# EAGLE design CO2_Sensor_SCD40 (EAGLE 9.6.2)
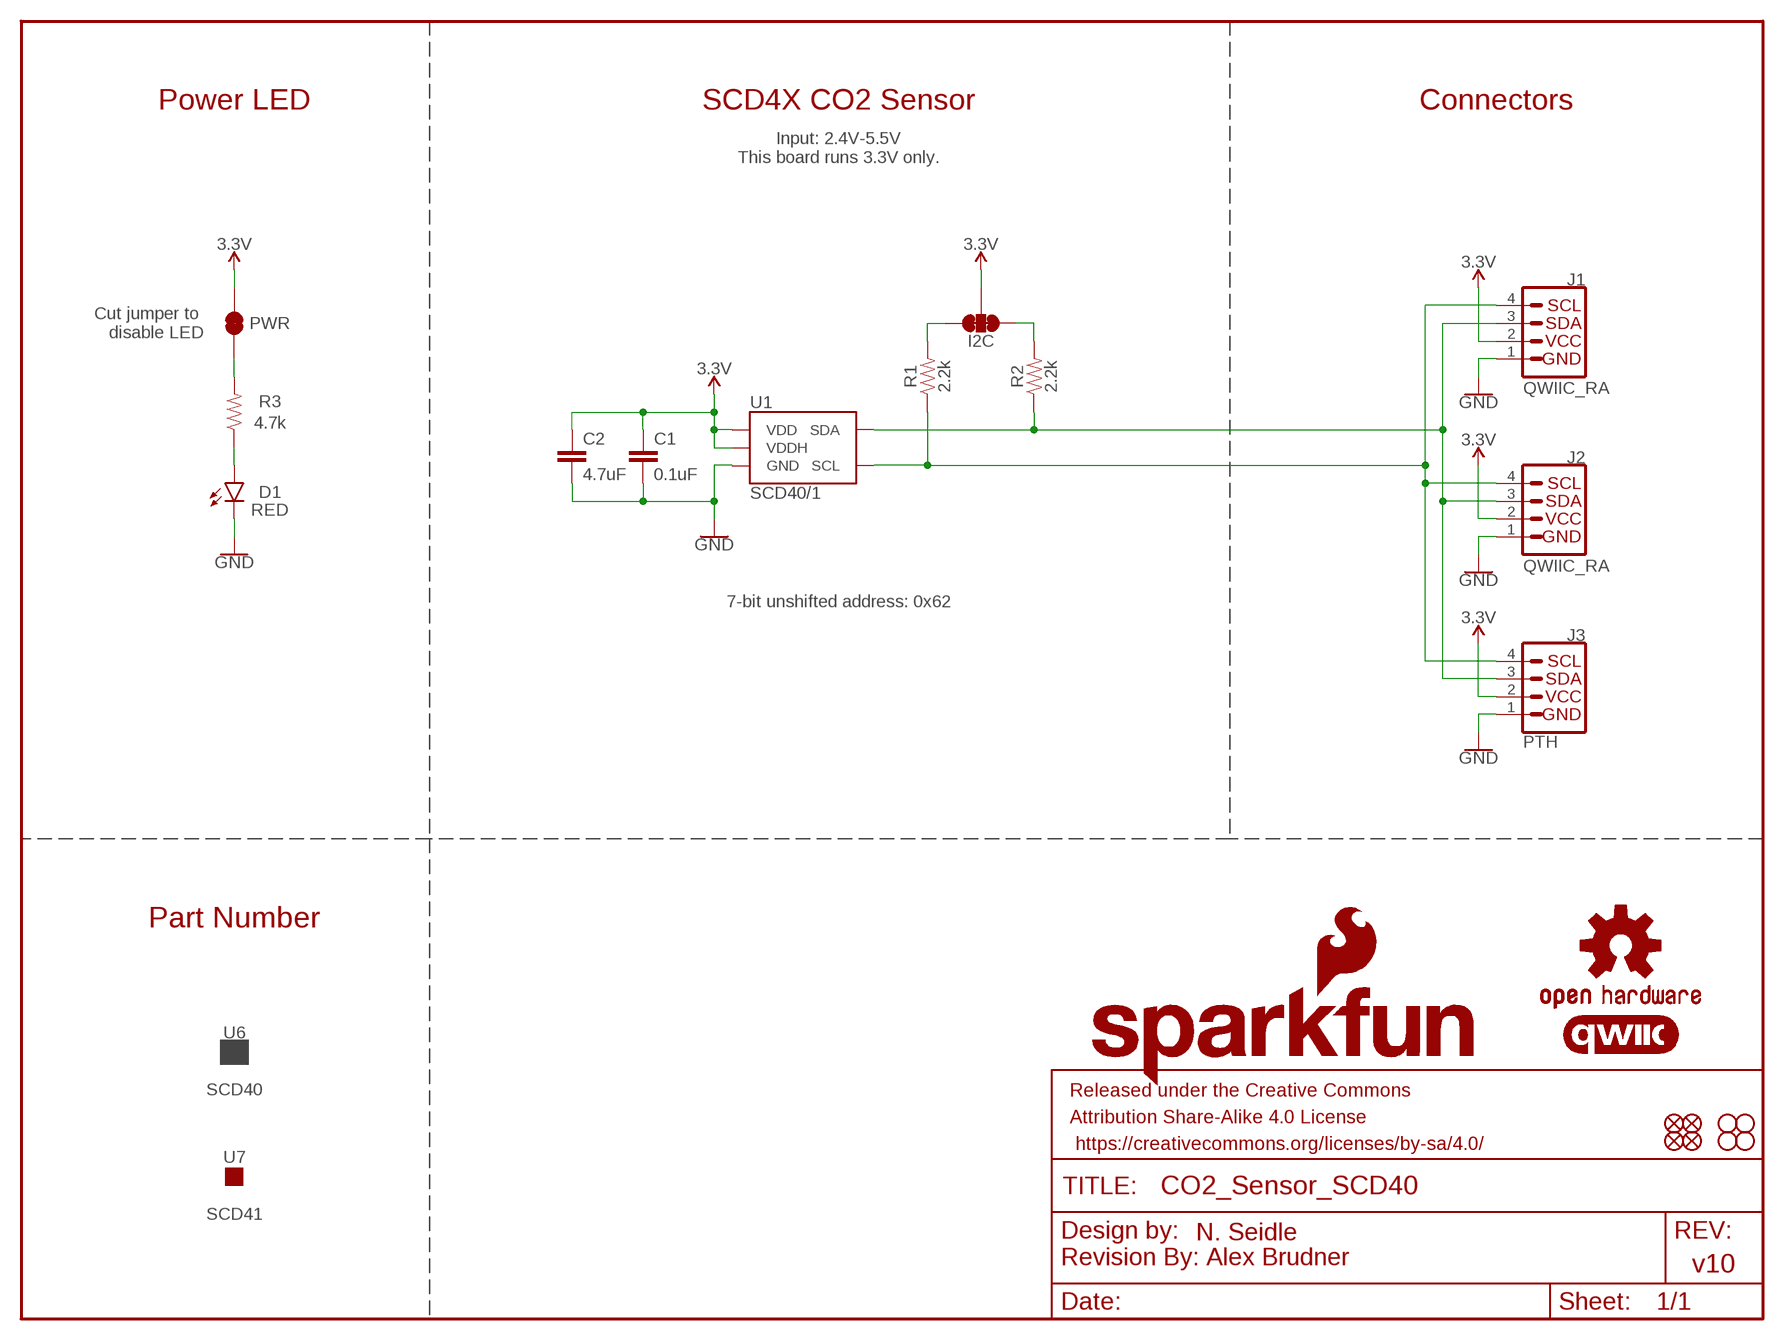
[diagram p0: schematic, sheet 1]

## Parts
C1  0.1uF  0.1UF-0603-25V-10%-X7R-WE  [0603]
C2  4.7uF  4.7UF-0603-6.3V-(10%)  [0603]
D1  RED  LED-RED_0603-KB  [LED-0603]
FD1  FIDUCIALUFIDUCIAL  [FIDUCIAL-MICRO]
FD2  FIDUCIALUFIDUCIAL  [FIDUCIAL-MICRO]
FD3  FIDUCIALUFIDUCIAL  [FIDUCIAL-MICRO]
FD4  FIDUCIALUFIDUCIAL  [FIDUCIAL-MICRO]
FRAME1  FRAME-LETTER  [CREATIVE_COMMONS]
H1  STAND-OFF  [STAND-OFF]
H2  STAND-OFF  [STAND-OFF]
H3  STAND-OFF  [STAND-OFF]
H4  STAND-OFF  [STAND-OFF]
I2C  I2C  JUMPER-SMT_3_2-NC_TRACE_SILK  [SMT-JUMPER_3_2-NC_TRACE_SILK]
J1  QWIIC_RA  QWIIC_CONNECTORJS-1MM  [JST04_1MM_RA]
J2  QWIIC_RA  QWIIC_CONNECTORJS-1MM  [JST04_1MM_RA]
J3  PTH  I2C_STANDARD_NO_SILK  [1X04_NO_SILK]
LOGO1  QWIIC_LOGO_CONNECTOR  [QWIIC_5.5MM]
LOGO2  OSHW-LOGOS  [OSHW-LOGO-S]
LOGO3  SFE_LOGO_NAME_FLAMEBLANK  [BLANK]
PWR  PWR  JUMPER-SMT_2_NC_TRACE_SILK  [SMT-JUMPER_2_NC_TRACE_SILK]
R1  2.2k  2.2KOHM-0603-1/10W-1%  [0603]
R2  2.2k  2.2KOHM-0603-1/10W-1%  [0603]
R3  4.7k  4.7KOHM-0603-1/10W-1%  [0603]
U1  SCD40/1  SCD4X  [SCD4X]
U6  SCD40  PROD_ID_PASTE_NO-SILK  [PRODUCT_IDENT_PASTE_NO-SILK]
U7  SCD41  PROD_ID_NO-PASTE_NO_SILK  [PRODUCT_IDENT_NO_NO-SILK]

## Nets
3.3V: C1.1 C2.1 I2C.2 J1.2 J2.2 J3.2 PWR.2 U1.7(VDD) U1.19(VDDH)
GND: C1.2 C2.2 D1.C J1.1 J2.1 J3.1 U1.6(GND) U1.20(GND) U1.CP(GND)
N$3: I2C.1 R2.2
N$4: I2C.3 R1.2
N$5: PWR.1 R3.2
N$6: D1.A R3.1
SCL: J1.4 J2.4 J3.4 R1.1 U1.9(SCL)
SDA: J1.3 J2.3 J3.3 R2.1 U1.10(SDA)

## Notes on the sheet
- Power LED | SCD4X CO2 Sensor | Connectors
- Input: 2.4V-5.5V
  This board runs 3.3V only.
- Cut jumper to 
  disable LED
- 7-bit unshifted address: 0x62
- Part Number

## Library data of the parts
C1 = SparkFun-Capacitors:0.1UF: 0.1µF ceramic capacitors A capacitor is a passive two-terminal electrical component used to store electrical energy temporarily in an electric field.; PROD_ID: CAP-16503
C2 = SparkFun-Capacitors:4.7UF: 4.7µF ceramic capacitors A capacitor is a passive two-terminal electrical component used to store electrical energy temporarily in an electric field.; PROD_ID: CAP-08280
D1 = SparkFun-LED:LED-RED: Red SMD LED Used in manufacturing of most products at SparkFun Packages: 0603 - KB - KingBright (DIO-17976) SMD 0603 package [Datasheet] <https://www.kingbrightusa.com/images/catalog/SPEC/APT1608SURCK.pdf> 0603 - (DIO-00819, has gone EOL) SMD 0603 package 0603 SMART - SMD 0603 SMART package ( more efficient and expensive)[Product Link] <http://www.osram-os.com/Graphics/XPic2/00077099_0.pdf> 1206 - SMD1206 package [Product Link] <https://www.sparkfun.com/datasheets/DevTools/LilyPad/Q150OVS4.pdff> SparkFun Products: Pro Mini 328 -5V <https://www.sparkfun.com/products/821> RedBoard <https://www.sparkfun.com/products/12757> IOIO-OTG <https://www.sparkfun.com/products/13613>; PROD_ID: DIO-17976
FD1-FD4 = SparkFun-Aesthetics:FIDUCIAL: Fiducial Alignment Points Point-of-reference for pick-and-place machines and other optical instruments.
FRAME1 = SparkFun-Aesthetics:FRAME-LETTER: Schematic Frame - Letter Standard 8.5x11 US Letter frame; BASEDON: Revision By: Alex Brudner; DESIGNER: N. Seidle; REV: v10
H1-H4 = SparkFun-Hardware:STAND-OFF: Stand Off Drill holes for mechanically mounting via screws, standoffs, etc. Note: Use the keepout ring to avoid running the screw head into surrounding components. Variant Overviews STAND-OFF - Mechanical footprint for a #4 phillips button head screw. STAND-OFF-TIGHT - Mechanical footprint for a #4 phillips button head screw, Example SparkFun Products Screw - Phillips Head (1/4", 4-40, 10 pack) <https://www.sparkfun.com/products/10453> (PRT-10453) Screw - Phillips Head (1/2", 4-40, 10 pack) <https://www.sparkfun.com/products/10452> (PRT-10452) Screw - Phillips Head (3/4", 4-40, 10 pack) <https://www.sparkfun.com/products/10451> (PRT-10451) Screw - Phillips Head (1", 4-40, 10 pack) <https://www.sparkfun.com/products/10450> (PRT-10450)
I2C = SparkFun-Jumpers:JUMPER-SMT_3_2-NC_TRACE: Normally closed trace jumper (2 of 2 connections) This jumper has a trace between all three pads so they are normally closed (NC). Use a razor knife to open the connection(s). For best results follow the IPC guidelines for cutting traces: Cutout at least 0.063 mm (0.005 in). Remove all loose material to clean up the cut area. Seal the cut with an approved epoxy. Reapply solder to reclose the connection(s).
J1 J2 = SparkFun-Connectors:QWIIC_CONNECTOR: SparkFun I2C Standard Qwiic Connector An SMD 1mm pitch JST connector makes it easy and quick (get it? Qwiic?) to connect I2C devices to each other. The Qwiic system <http://www.sparkfun.com/qwiic> enables fast and solderless connection between popular platforms and various sensors and actuators. We carry 200mm <https://www.sparkfun.com/products/14204>, 100mm <https://www.sparkfun.com/products/14205>, 50mm <https://www.sparkfun.com/products/14206>, and breadboard friendly <https://www.sparkfun.com/products/14207> Qwiic cables. We also offer 10 pcs strips <https://www.sparkfun.com/products/14323> the SMD connectors.; PROD_ID: CONN-13694; VALUE: QWIIC_RIGHT_ANGLE
J3 = SparkFun-Connectors:I2C_STANDARD: SparkFun I2C Standard Pinout Header SparkFun has standardized on a pinout for all I2C based sensor breakouts. This pinout allows I2C boards to be plugged directly into the headers on Arduino Uno compatible boards, and to be daisy chained easily. Example SparkFun Products: SparkFun Atmospheric Sensor Breakout - BME280 <https://www.sparkfun.com/products/13676> SparkFun Altitude/Pressure Sensor Breakout - MPL3115A2 <https://www.sparkfun.com/products/11084> SparkFun TOF Range Finder Sensor - VL6180 <https://www.sparkfun.com/products/12785>
LOGO1 = SparkFun-Aesthetics:QWIIC_LOGO: Qwiic Logos for placement on schematic and PCB. The 5.5mm silk logo is best for placing next to Qwiic connector.
LOGO2 = SparkFun-Aesthetics:OSHW-LOGO: Open-Source Hardware (OSHW) Logo This logo indicates the piece of hardware it is found on incorporates a OSHW license and/or adheres to the definition of open source hardware found here: http://freedomdefined.org/OSHW
LOGO3 = SparkFun-Aesthetics:SFE_LOGO_NAME_FLAME: SparkFun Font Logo w/ Flame This is the SparkFun full logo. The logo on the schematic will always be the same size; the package variant is the height of the flame part of the logo. Default layer for the logo on the board is tSilk.
PWR = SparkFun-Jumpers:JUMPER-SMT_2_NC_TRACE: Normally closed trace jumper This jumper has a trace between two pads so it's normally closed (NC). Use a razor knife to open the connection. For best results follow the IPC guidelines for cutting traces: Cutout at least 0.063 mm (0.005 in). Remove all loose material to clean up the cut area. Seal the cut with an approved epoxy. Reapply solder to reclose the connection.
R1 R2 = SparkFun-Resistors:2.2KOHM: 2.2kΩ resistor A resistor is a passive two-terminal electrical component that implements electrical resistance as a circuit element. Resistors act to reduce current flow, and, at the same time, act to lower voltage levels within circuits. - Wikipedia; PROD_ID: RES-08272
R3 = SparkFun-Resistors:4.7KOHM: 4.7kΩ resistor A resistor is a passive two-terminal electrical component that implements electrical resistance as a circuit element. Resistors act to reduce current flow, and, at the same time, act to lower voltage levels within circuits. - Wikipedia; PROD_ID: RES-07857
U1 = SCD4X:SCD4X: The SGP40 is a digital gas sensor designed for easy integration into air purifiers or demand-controlled ventilation systems.; PROD_ID: IC-16006; PROD_ID2: IC-16053
U6 = SparkFun-Aesthetics:PROD_ID_PASTE
U7 = SparkFun-Aesthetics:PROD_ID_NO-PASTE

## Board
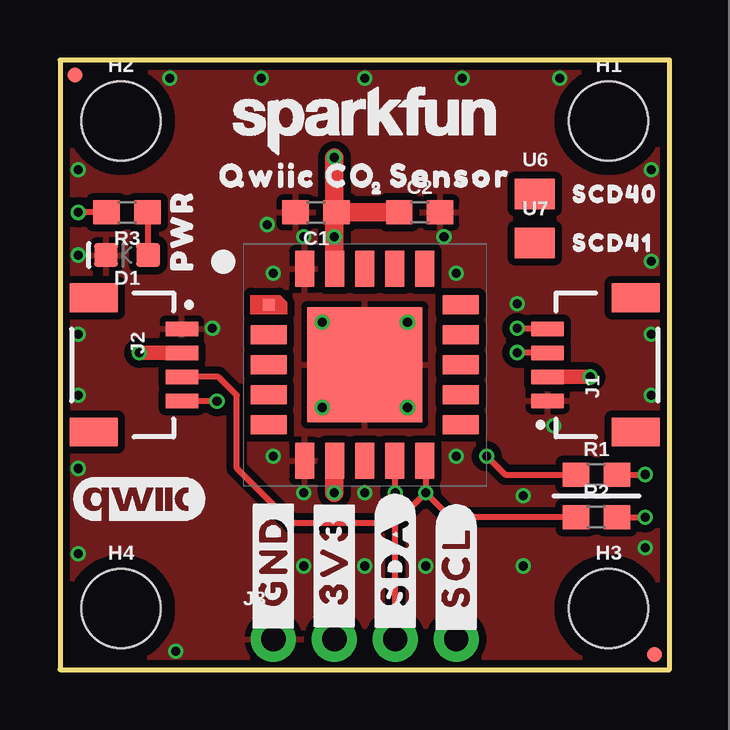
[diagram p1: board, top side]
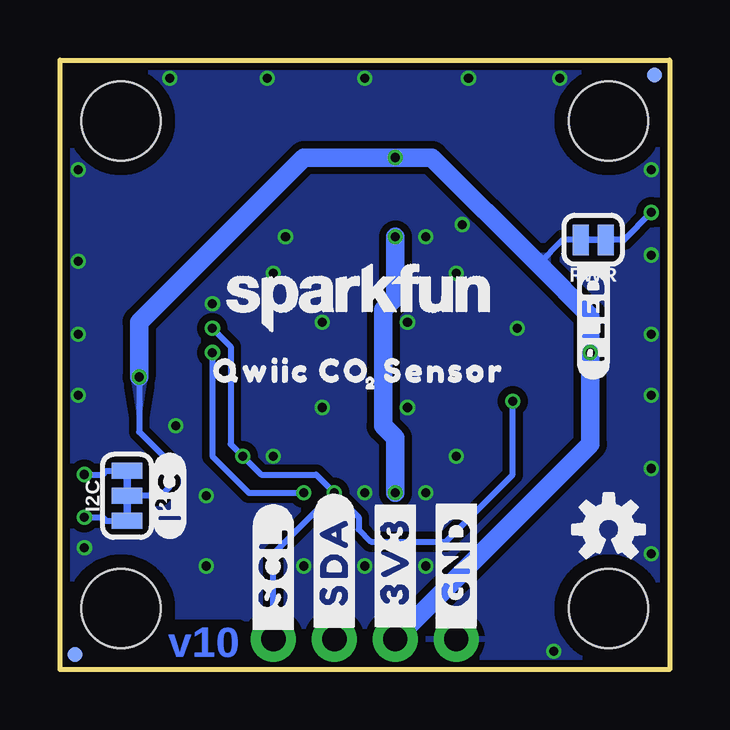
[diagram p2: board, bottom side, seen from below]

Size 25.4 x 25.4 mm. Coordinates in mm from the lower left corner, seen from the top.
Outline: 0,0 25.4,0 25.4,25.4 0,25.4 0,0
Copper layers (1*16): Top 0.035mm / dielectric 1.5mm / Bottom 0.035mm
Design rules "SparkFun-2-Layer-Minimum-JLCPCB": minimum track width 5mil, minimum drill 0.3mm, track to track 5mil, track to pad 5mil, pad to pad 5mil, via to via 5mil, smd to smd 5mil, copper to edge 7mil, drill to drill 7mil, minimum pad ring 5mil, minimum via ring 5mil, stop-mask expansion 2.5mil, vias tented up to drill 25mil, thermal gap 10mil

### Footprints (pad centres in the part's own frame; a part is rotated, then mirrored left to right if it is on the bottom)
0603 = smd 1.1 x 1: 1 -0.85,0; 2 0.85,0
LED-0603 = smd 1 x 1: A -0.877,0; C 0.877,0
FIDUCIAL-MICRO = smd 0.635 x 0.635: 1 0,0
STAND-OFF = hole 3.302: 0,0
SMT-JUMPER_3_2-NC_TRACE_SILK = smd 0.66 x 1.27: 1 -1.041,0; 2 0,0; 3 1.041,0
JST04_1MM_RA = smd 0.6 x 1.35: 1 -1.5,0; 2 -0.5,0; 3 0.5,0; 4 1.5,0 | smd 1.2 x 2: NC1 2.8,-3.675; NC2 -2.8,-3.675
1X04_NO_SILK = drill 1.016 pad 1.88: 1 0,0; 2 2.54,0; 3 5.08,0; 4 7.62,0
SMT-JUMPER_2_NC_TRACE_SILK = smd 0.66 x 1.27: 1 -0.521,0; 2 0.521,0
SCD4X = smd 0.5 x 0.5: 1 -4,2.5 | smd 1.5 x 0.8: 2 -4,1.25; 3 -4,0; 4 -4,-1.25; 5 -4,-2.5; 11 4,-2.5; 12 4,-1.25; 13 4,0; 14 4,1.25; 15 4,2.5 | smd 0.8 x 1.5: 6 -2.5,-4; 7 -1.25,-4; 8 0,-4; 9 1.25,-4; 10 2.5,-4; 16 2.5,4; 17 1.25,4; 18 0,4; 19 -1.25,4; 20 -2.5,4 | smd 4.8 x 4.8: CP 0,0
PRODUCT_IDENT_PASTE_NO-SILK = smd 1.676 x 1.27: 1 -0.025,0
PRODUCT_IDENT_NO_NO-SILK = smd 1.676 x 1.27: 1 -0.025,0

### Placement (x,y rotation side)
C1  10.67,19.05 180 top
C2  14.99,19.05 0 top
D1  2.79,17.27 180 top
FD1  24.77,0.64 0 bottom
FD2  0.64,24.77 0 bottom
FD3  0.64,24.77 0 top
FD4  24.77,0.64 0 top
FRAME1  50.8,-23.37 0 top  (outside the outline)
H1  22.86,22.86 0 top
H2  2.54,22.86 0 top
H3  22.86,2.54 0 top
H4  2.54,2.54 0 top
I2C  22.61,7.24 90 bottom
J1  20.32,12.7 90 top
J2  5.08,12.7 270 top
J3  8.89,1.27 0 top
LOGO1  3.3,7.11 0 top
LOGO2  2.54,5.84 0 bottom
LOGO3  28.45,0 0 top  (outside the outline)
PWR  3.19,17.91 180 bottom
R1  22.35,8.13 0 top
R2  22.35,6.35 0 top
R3  2.79,19.05 180 top
U1  12.7,12.7 0 top
U6  19.81,19.81 0 top
U7  19.81,17.78 0 top
U$1  [#_GND#14]  8.89,4.32 90 top
U$2  [#_3V3#15]  11.43,4.32 90 top
U$3  [#_SDA#15]  13.97,4.32 90 top
U$4  [#_SCL#16]  16.51,4.06 90 top
U$5  [SFE_LOGO_NAME_.1]  12.7,22.86 0 top
U$6  [SCD414140404021]  20.83,17.78 0 top
U$7  [SCD40414140404022]  20.83,19.81 0 top
U$8  [QWIIC_CO0]  9.91,20.57 0 top
U$9  [SENSOR0]  16.26,20.57 0 top
U$10  [20]  13.21,20.07 0 top
U$11  [SFE_LOGO_FLAME_STOP_.1]  22.86,18.8 0 bottom
U$12  [SFE_LOGO_NAME_.1]  12.95,15.49 0 bottom
U$13  [QWIIC_CO0]  15.75,12.45 0 bottom
U$14  [SENSOR0]  9.4,12.45 0 bottom
U$15  [20]  12.45,11.94 0 bottom
U$16  [#PLED#21]  3.17,14.68 90 bottom
U$17  [#I�C#0]  20.83,7.24 90 bottom
U$18  [#_GND#14]  8.89,4.32 90 bottom
U$19  [#_3V3#15]  11.43,4.32 90 bottom
U$20  [#_SDA#15]  13.97,4.32 90 bottom
U$21  [#_SCL#16]  16.51,4.06 90 bottom
U$22  [ORDERING_INSTRUCTIONS]  27.94,36.07 0 top  (outside the outline)
U$23  [PWR0]  5.08,18.29 90 top

### Tracks (layer width: path | path; a pad name or v marks a point on that pad's centre or on a via)
3.3V  (via drill 0.38)
  Top 0.61: J1.2 v22.09,12.2 v22.1,12.19 | J2.2 v3.31,13.2 v3.3,13.21
  Top 0.762: v11.43,21.34 11.43,19.14 C1.1 | C1.1 11.43,18.96 v11.43,18.03 11.43,16.72 U1.19 | v11.43,7.37 11.43,8.68 U1.7 | C1.1 C2.1
  Bottom 0.254: v22.1,12.19 22.1,9.91 20.83,8.64 20.83,7.62 21.21,7.24 I2C.2 | PWR.2 4.45,17.91 5.46,16.89
  Bottom 0.762: J3.2 3.3,9.4 v3.3,13.21 3.3,14.73 5.46,16.89 9.91,21.34 v11.43,21.34 15.24,21.34 22.1,14.48 v22.1,12.19 | v11.43,18.03 11.43,15.49 11.94,14.99 11.94,10.16 11.43,9.65 v11.43,7.37
  pour Bottom (isolate 0.305): 21.84,12.19 22.35,12.19 22.1,10.67
  pour Bottom (isolate 0.305): 5.08,17.27 5.08,16.51 5.84,17.27
GND  (via drill 0.38)
  other vias: 0.76,17.27 0.76,4.83 0.76,8.38 0.76,13.97 0.76,11.43 6.35,14.22 10.16,18.03 8.64,18.54 16,18.03 20.57,10.16 19.3,7.24 12.7,7.37 8.89,8.89 10.16,7.37 24.38,5.08 4.83,0.76 12.7,4.32 15.24,4.32 19.3,4.32 0.76,20.83 4.57,24.64 20.83,24.64 12.7,24.64 8.38,24.64 16.76,24.64 24.64,20.83 24.64,17.02 24.64,13.97 24.64,11.43 19.05,15.24 8.89,16.51 16.51,16.51 16.51,8.89 14.48,14.48 14.48,10.92 10.92,14.48 10.92,10.92 10.16,4.32
  pour Top (isolate 0.305): 0,25.4 0,0 25.4,0 25.4,25.4
  pour Bottom (isolate 0.305, rank 2): 0,25.4 0,0 25.4,0 25.4,25.4
N$3  (via drill 0.38)
  Top 0.254: R2.2 v24.38,6.35
  Bottom 0.254: v24.38,6.35 23.62,6.35 23.47,6.2 I2C.1
N$4  (via drill 0.38)
  Top 0.254: R1.2 v24.38,8.13
  Bottom 0.254: v24.38,8.13 23.62,8.13 23.47,8.28 I2C.3
N$5  (via drill 0.38)
  Top 0.254: R3.2 v0.76,19.05
  Bottom 0.127: 1.89,17.92 1.91,17.91
  Bottom 0.254: v0.76,19.05 1.89,17.92 | 1.91,17.91 PWR.1
N$6
  Top 0.254: D1.A 3.67,19.02 R3.1
SCL  (via drill 0.38)
  Top 0.254: v13.97,7.37 13.97,8.68 U1.9 | J1.4 19.07,14.2 v19.05,14.22 | v17.78,8.89 18.54,8.13 R1.1 | v6.54,11.18 5.1,11.18 J2.4
  Bottom 0.254: J3.4 16.51,4.83 v13.97,7.37 | v6.54,11.18 6.54,8.13 9.34,5.33 12.45,5.33 12.95,5.84 12.95,6.35 v13.97,7.37 | v19.05,14.22 18.29,13.46 18.29,9.4 v17.78,8.89 17.02,8.13 14.73,8.13 v13.97,7.37
SDA  (via drill 0.38)
  Top 0.254: J3.3 13.97,6.1 | R2.1 16.26,6.35 v15.24,7.37 | U1.10 15.24,8.66 v15.24,7.37 | v15.24,7.37 13.97,6.1 | 13.97,6.1 9.65,6.1 7.37,8.38 7.37,11.43 6.6,12.2 J2.3 | J1.3 v19.06,13.2 v19.05,13.21
  Bottom 0.254: v19.05,13.21 19.05,8.89 17.53,7.37 v15.24,7.37

### Text on the board
Bottom: v10
Measures: Units in inches.
tDocu: Layers: 2 / Thickness: 1.6mm / Solder Mask: Red / Finish: Lead-Free HASL | Alex Brudner